# EAGLE design tactilePop (EAGLE 9.6.2)
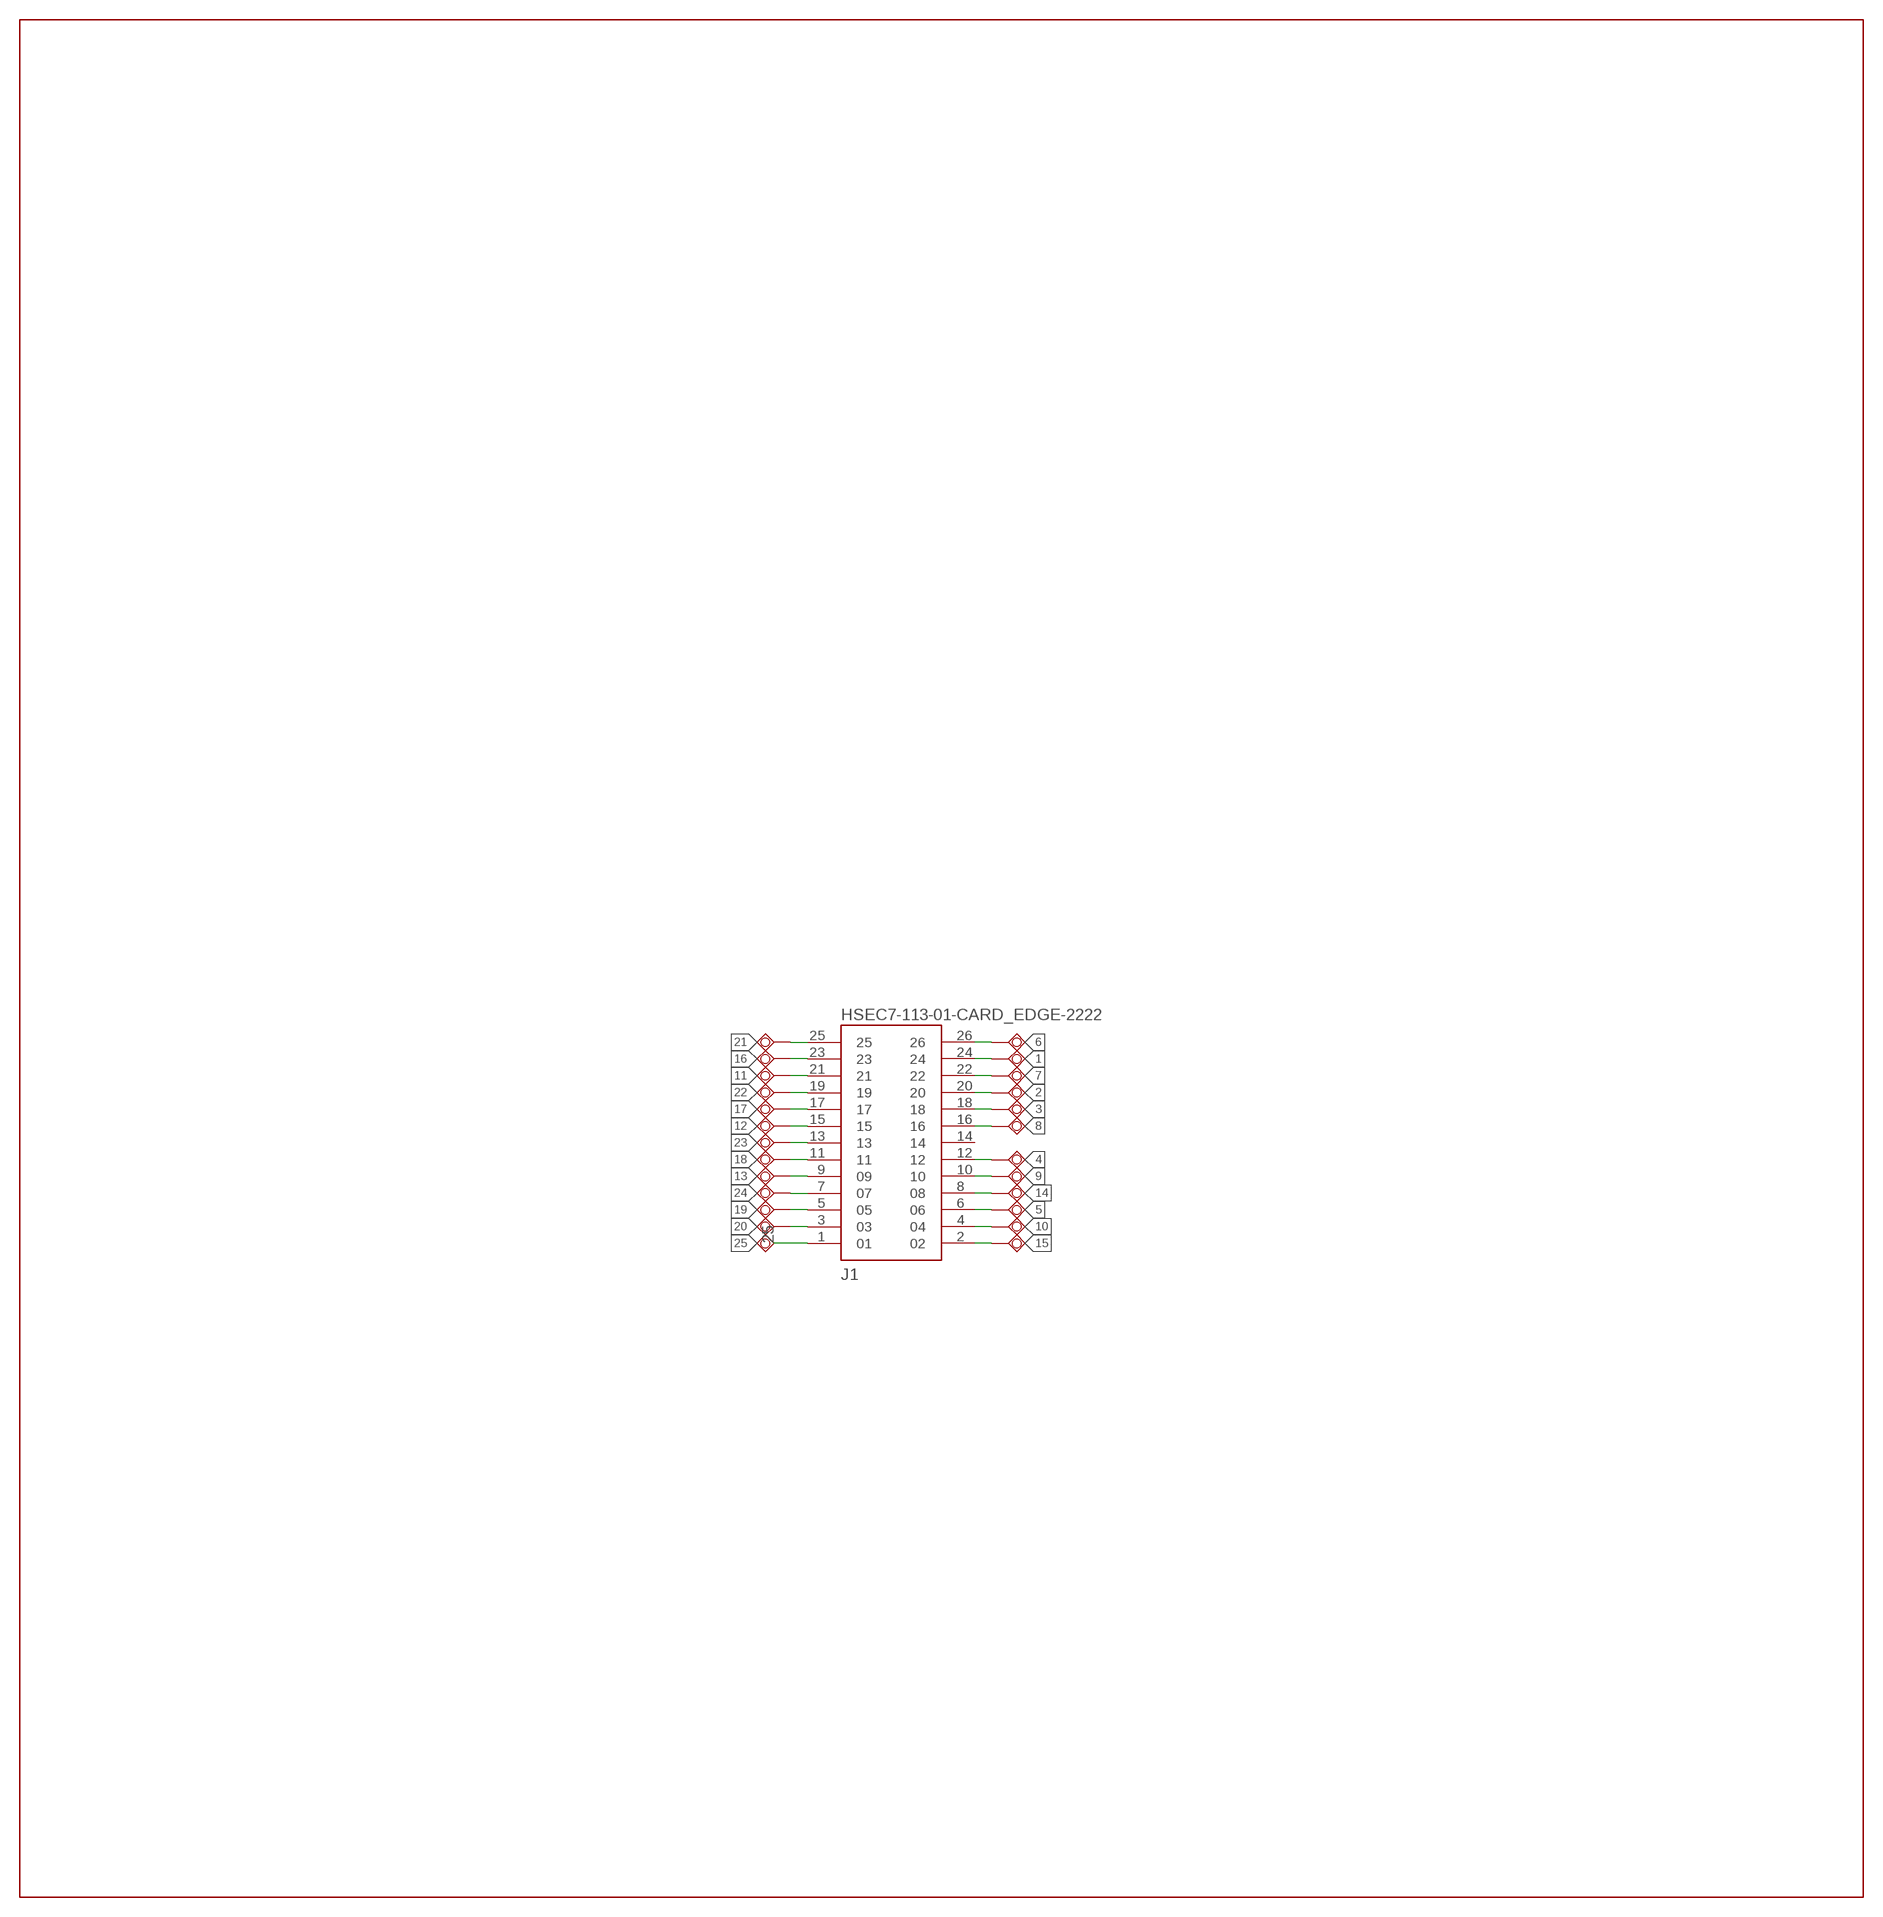
[diagram p0: schematic, sheet 1]

## Parts
1  TESTPAD_TPSQB2,54  [TESTPAD_B2,54]
2  TESTPAD_TPSQB2,54  [TESTPAD_B2,54]
3  TESTPAD_TPSQB2,54  [TESTPAD_B2,54]
J1  HSEC7-113-01-CARD_EDGE-2222  [HSEC8-113-01-X-RA-L2]
TP1  TESTPAD_TPSQB2,54  [TESTPAD_B2,54]
TP3  TESTPAD_TPSQB2,54  [TESTPAD_B2,54]
TP6  TESTPAD_TPSQB2,54  [TESTPAD_B2,54]
TP7  TESTPAD_TPSQB2,54  [TESTPAD_B2,54]
TP8  TESTPAD_TPSQB2,54  [TESTPAD_B2,54]
TP9  TESTPAD_TPSQB2,54  [TESTPAD_B2,54]
TP10  TESTPAD_TPSQB2,54  [TESTPAD_B2,54]
TP11  TESTPAD_TPSQB2,54  [TESTPAD_B2,54]
TP12  TESTPAD_TPSQB2,54  [TESTPAD_B2,54]
TP13  TESTPAD_TPSQB2,54  [TESTPAD_B2,54]
TP14  TESTPAD_TPSQB2,54  [TESTPAD_B2,54]
TP15  TESTPAD_TPSQB2,54  [TESTPAD_B2,54]
TP16  TESTPAD_TPSQB2,54  [TESTPAD_B2,54]
TP17  TESTPAD_TPSQB2,54  [TESTPAD_B2,54]
TP18  TESTPAD_TPSQB2,54  [TESTPAD_B2,54]
TP19  TESTPAD_TPSQB2,54  [TESTPAD_B2,54]
TP20  TESTPAD_TPSQB2,54  [TESTPAD_B2,54]
TP21  TESTPAD_TPSQB2,54  [TESTPAD_B2,54]
TP22  TESTPAD_TPSQB2,54  [TESTPAD_B2,54]
TP23  TESTPAD_TPSQB2,54  [TESTPAD_B2,54]
TP24  TESTPAD_TPSQB2,54  [TESTPAD_B2,54]
TP25  TESTPAD_TPSQB2,54  [TESTPAD_B2,54]

## Nets
1: 1.TP J1.24
2: 2.TP J1.20
3: 3.TP J1.18
4: J1.12 TP7.TP
5: J1.6 TP19.TP
6: J1.26 TP1.TP
7: J1.22 TP3.TP
8: J1.16 TP6.TP
9: J1.10 TP8.TP
10: J1.4 TP10.TP
11: J1.21 TP24.TP
12: J1.15 TP21.TP
13: J1.9 TP16.TP
14: J1.8 TP20.TP
15: J1.2 TP11.TP
16: J1.23 TP25.TP
17: J1.17 TP22.TP
18: J1.11 TP17.TP
19: J1.5 TP14.TP
20: J1.3 TP13.TP
21: J1.25 TP9.TP
22: J1.19 TP23.TP
23: J1.13 TP18.TP
24: J1.7 TP15.TP
25: J1.1 TP12.TP
Unconnected: J1.14

## Library data of the parts
1-3 TP1 TP3 TP6-TP25 = electroTactilePads:TESTPAD_TPSQ: Test pad
J1 = HSEC8-113-01:HSEC7-113-01-CARD_EDGE: MicroMod Connector Description: A card edge connector and mating PCB connector to allow various MicroMod Processor Boards to be coupled with various carrier boards of different capabilities. Based on the M.2 standard.

## Net classes
0 default: width 0.381 mm

## Board
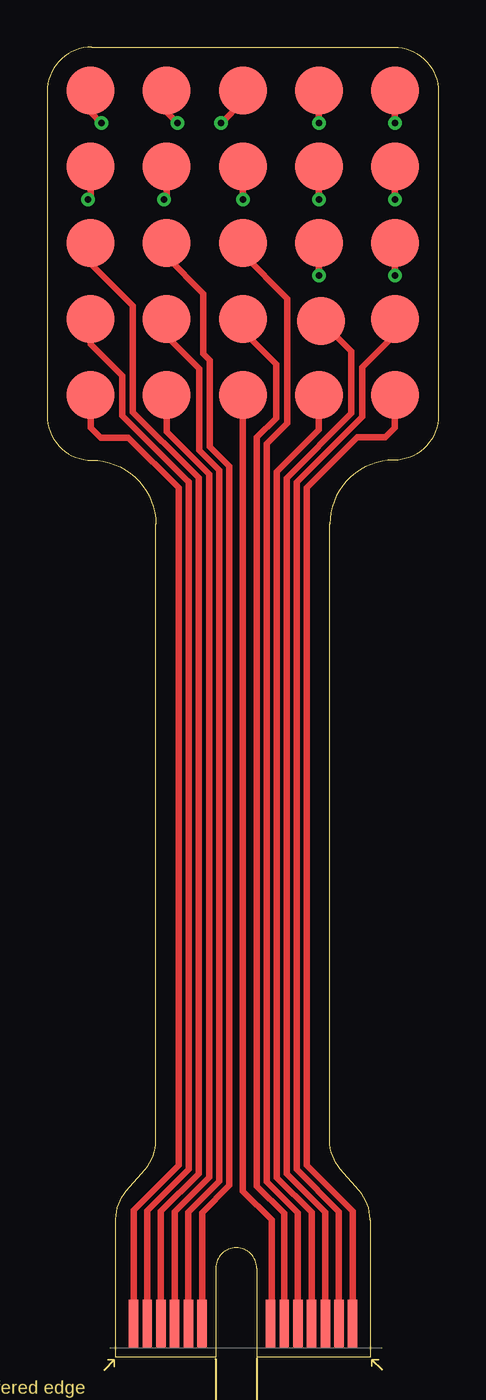
[diagram p1: board, top side]
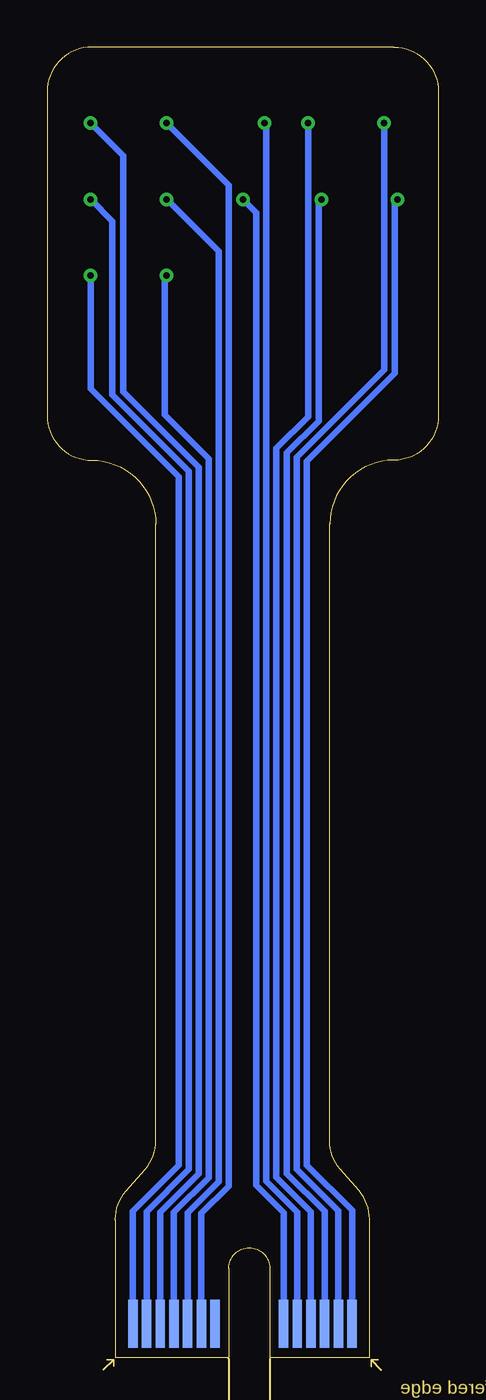
[diagram p2: board, bottom side, seen from below]

Size 22.86 x 76.53 mm. Coordinates in mm from the lower left corner, seen from the top.
Outline: 4.02,8 4.02,8.06 arc-41 4.64,9.71 5.73,10.98 arc41 6.35,12.64 6.35,48.65 arc90 2.6,52.4 arc-90 0,55 0,73.93 arc-90 2.6,76.53 20.26,76.53 arc-90 22.86,73.93 22.86,55 arc-90 20.26,52.4 arc90 16.51,48.65 16.51,12.65 arc41 17.14,10.98 18.24,9.72 arc-41 18.87,8.05 18.87,8
Copper layers (1*16): Top 0.035mm / dielectric 1.5mm / Bottom 0.035mm
Design rules "default *": minimum track width 6mil, minimum drill 0.35mm, track to track 8mil, track to pad 8mil, pad to pad 8mil, via to via 8mil, smd to smd 0mil, copper to edge 40mil, drill to drill 6mil, minimum pad ring 10mil, minimum via ring 8mil, stop-mask expansion 0mil, vias tented up to drill 15mil, thermal gap 10mil

### Footprints (pad centres in the part's own frame; a part is rotated, then mirrored left to right if it is on the bottom)
TESTPAD_B2,54 = smd 2.794 x 2.794: TP 0,0
HSEC8-113-01-X-RA-L2 = smd 0.55 x 2.8: 1 6.8,1.965; 3 6,1.965; 5 5.2,1.965; 7 4.4,1.965; 9 3.6,1.965; 11 2.8,1.965; 13 2,1.965; 15 -2,1.965; 17 -2.8,1.965; 19 -3.6,1.965; 21 -4.4,1.965; 23 -5.2,1.965; 25 -6,1.965 | smd 0.55 x 2.8 bottom: 2 6.8,1.965; 4 6,1.965; 6 5.2,1.965; 8 4.4,1.965; 10 3.6,1.965; 12 2.8,1.965; 14 2,1.965; 16 -2,1.965; 18 -2.8,1.965; 20 -3.6,1.965; 22 -4.4,1.965; 24 -5.2,1.965; 26 -6,1.965

### Placement (x,y rotation side)
1  2.54,73.99 0 top
2  6.98,73.99 0 top
3  11.43,73.99 0 top
J1  11.05,0 0 top
TP1  2.54,69.55 0 top
TP3  6.98,69.55 0 top
TP6  11.43,69.55 0 top
TP7  15.88,73.99 0 top
TP8  15.88,69.55 0 top
TP9  2.54,56.21 0 top
TP10  20.32,69.55 0 top
TP11  20.32,65.1 0 top
TP12  20.32,56.21 0 top
TP13  20.32,60.66 0 top
TP14  16,60.53 0 top
TP15  15.88,56.21 0 top
TP16  11.43,65.1 0 top
TP17  11.43,60.66 0 top
TP18  11.43,56.21 0 top
TP19  20.32,73.99 0 top
TP20  15.88,65.1 0 top
TP21  6.98,65.1 0 top
TP22  6.98,60.66 0 top
TP23  6.98,56.21 0 top
TP24  2.54,65.1 0 top
TP25  2.54,60.66 0 top

### Tracks (layer width: path | path; a pad name or v marks a point on that pad's centre or on a via)
1  (via drill 0.38)
  Top 0.381: v3.18,72.08 2.54,72.72 1.TP
  Bottom 0.381: v3.18,72.08 3.18,57.67 8.27,52.58 8.27,10.97 5.85,8.55 J1.24
2  (via drill 0.38)
  Top 0.381: v7.62,72.08 6.98,72.72 2.TP
  Bottom 0.381: v7.62,72.08 7.62,54.94 9.47,53.09 9.47,10.52 7.45,8.5 J1.20
3  (via drill 0.38)
  Top 0.381: v10.16,72.08 11.43,73.36 3.TP
  Bottom 0.381: v10.16,72.08 10.06,71.98 10.06,10.28 8.25,8.47 J1.18
4  (via drill 0.38)
  Top 0.381: v15.88,72.08 TP7.TP
  Bottom 0.381: v15.88,72.08 12.26,68.47 12.26,10 13.85,8.4 J1.12
5  (via drill 0.38)
  Top 0.381: v20.32,72.08 TP19.TP
  Bottom 0.381: v20.32,72.08 18.41,70.18 18.41,56.4 14.01,51.99 14.01,10.72 16.25,8.48 J1.6
6  (via drill 0.38)
  Top 0.381: v2.39,67.64 2.54,67.79 TP1.TP
  Bottom 0.381: v2.39,67.64 2.54,67.64 2.54,57.48 7.68,52.34 7.68,11.21 5.05,8.57 J1.26
7  (via drill 0.38)
  Top 0.381: v6.83,67.64 6.98,67.64 TP3.TP
  Bottom 0.381: v6.83,67.64 6.98,67.64 6.98,54.69 8.85,52.82 8.85,10.72 6.65,8.52 J1.22
8  (via drill 0.38)
  Top 0.381: v11.43,67.64 TP6.TP
  Bottom 0.381: v11.43,67.64 10.64,66.85 10.64,10.04 9.05,8.44 J1.16
9  (via drill 0.38)
  Top 0.381: TP8.TP v15.88,67.64
  Bottom 0.381: v15.88,67.64 12.84,64.61 12.84,10.24 14.65,8.43 J1.10
10  (via drill 0.38)
  Top 0.381: v20.32,67.64 TP10.TP
  Bottom 0.381: v20.32,67.64 19.05,66.37 19.05,56.21 14.59,51.75 14.59,10.97 17.05,8.51 J1.4
11
  Top 0.381: TP24.TP 2.54,63.89 5,61.43 5,55.21 8.5,51.71 8.51,51.71 8.85,51.37 8.85,10.72 6.65,8.52 J1.21
12
  Top 0.381: TP21.TP 6.98,64.28 9.13,62.13 9.13,58.61 9.51,58.23 9.51,53.19 10.64,52.06 10.64,10.04 9.05,8.44 J1.15
13
  Top 0.381: TP16.TP 11.43,64.44 14.04,61.84 14.04,58.38 14.04,54.55 12.84,53.35 12.84,10.24 14.65,8.43 J1.9
14  (via drill 0.38)
  Top 0.381: v15.88,63.19 TP20.TP
  Bottom 0.381: v15.88,63.19 16,63.07 16,55.07 13.42,52.49 13.42,10.62 13.42,10.48 15.45,8.46 J1.8
15  (via drill 0.38)
  Top 0.381: v20.32,63.19 TP11.TP
  Bottom 0.381: v20.32,63.19 20.32,56.56 15.18,51.42 15.18,11.21 17.85,8.53 J1.2
16
  Top 0.381: TP25.TP 2.54,59.17 4.39,57.32 4.39,54.99 8.25,51.13 8.27,51.13 8.27,10.97 5.85,8.55 J1.23
17
  Top 0.381: TP22.TP 6.98,59.64 8.89,57.74 8.89,52.99 10.06,51.82 10.06,10.28 8.25,8.47 J1.17
18
  Top 0.381: TP17.TP 11.43,59.97 13.38,58.02 13.38,54.86 12.26,53.73 12.26,10 13.85,8.4 J1.11
19
  Top 0.381: TP14.TP 17.78,58.75 17.78,55.13 14.01,51.36 14.01,10.72 16.25,8.48 J1.5
20
  Top 0.381: TP13.TP 20.32,59.73 18.4,57.81 18.4,54.93 14.59,51.12 14.59,10.97 17.05,8.51 J1.3
21
  Top 0.381: TP9.TP 2.54,54.3 3.12,53.72 4.74,53.72 7.68,50.78 7.68,11.21 5.05,8.57 J1.25
22
  Top 0.381: TP23.TP 6.98,54.06 9.47,51.58 9.47,10.52 7.45,8.5 J1.19
23
  Top 0.381: J1.13 13.11,2.03 13.11,8.02 11.43,9.7 TP18.TP
24
  Top 0.381: 15.88,55.58 TP15.TP 15.88,54.18 13.42,51.73 13.42,10.48 15.45,8.46 J1.7
25
  Top 0.381: TP12.TP 20.32,54.3 19.75,53.73 18.13,53.73 15.18,50.78 15.18,11.21 17.85,8.53 J1.1